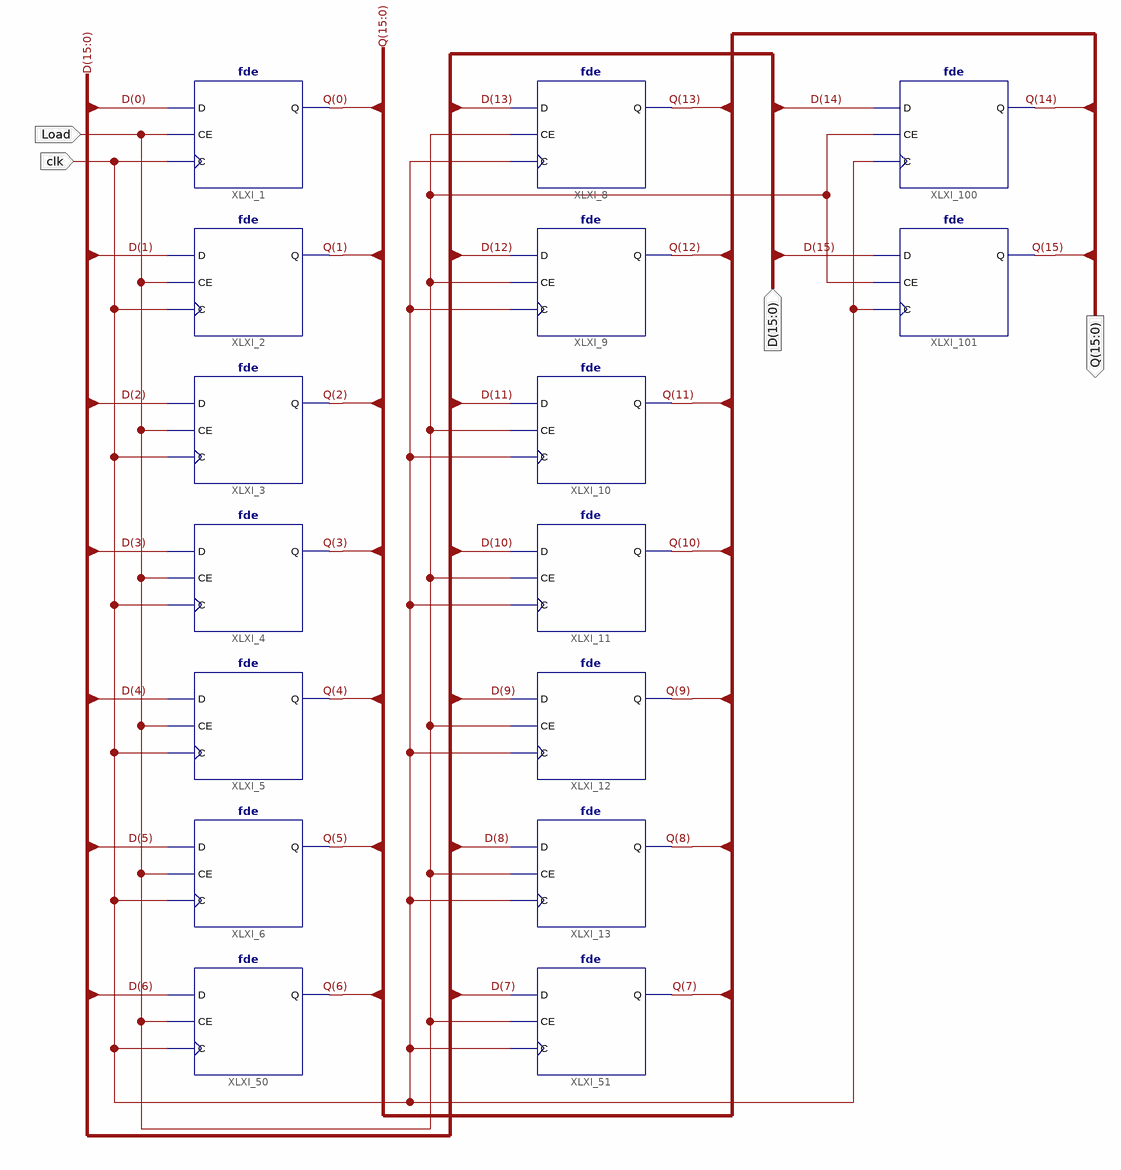
[diagram p0: schematic sheet 1]
// Xilinx ISE schematic dff_16bit.sch (spartan6) as structural Verilog: 16 symbols, 4 ports
module dff_16bit (
  input  clk,
  input  [15:0] D,
  input  Load,
  output [15:0] Q
);

  fde XLXI_1 (.C(clk), .CE(Load), .D(D[0]), .Q(Q[0]));
  fde XLXI_2 (.C(clk), .CE(Load), .D(D[1]), .Q(Q[1]));
  fde XLXI_50 (.C(clk), .CE(Load), .D(D[6]), .Q(Q[6]));
  fde XLXI_6 (.C(clk), .CE(Load), .D(D[5]), .Q(Q[5]));
  fde XLXI_5 (.C(clk), .CE(Load), .D(D[4]), .Q(Q[4]));
  fde XLXI_4 (.C(clk), .CE(Load), .D(D[3]), .Q(Q[3]));
  fde XLXI_3 (.C(clk), .CE(Load), .D(D[2]), .Q(Q[2]));
  fde XLXI_100 (.C(clk), .CE(Load), .D(D[14]), .Q(Q[14]));
  fde XLXI_101 (.C(clk), .CE(Load), .D(D[15]), .Q(Q[15]));
  fde XLXI_51 (.C(clk), .CE(Load), .D(D[7]), .Q(Q[7]));
  fde XLXI_13 (.C(clk), .CE(Load), .D(D[8]), .Q(Q[8]));
  fde XLXI_12 (.C(clk), .CE(Load), .D(D[9]), .Q(Q[9]));
  fde XLXI_11 (.C(clk), .CE(Load), .D(D[10]), .Q(Q[10]));
  fde XLXI_9 (.C(clk), .CE(Load), .D(D[12]), .Q(Q[12]));
  fde XLXI_10 (.C(clk), .CE(Load), .D(D[11]), .Q(Q[11]));
  fde XLXI_8 (.C(clk), .CE(Load), .D(D[13]), .Q(Q[13]));
endmodule
